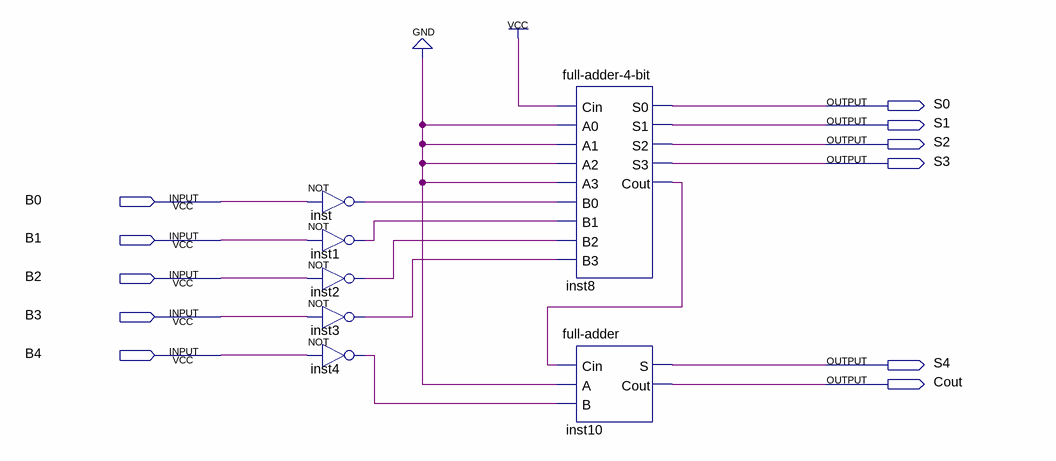
[diagram p0: schematic sheet]
// Quartus schematic bloco_Complemento2.bdf as structural Verilog: 7 symbols, 11 pins
module bloco_Complemento2 (
  input  B0,
  input  B1,
  input  B2,
  input  B3,
  input  B4,
  output S0,
  output S1,
  output S2,
  output S3,
  output S4,
  output Cout
);

  wire inst1_out, inst2_out, inst3_out, inst4_out, inst8_cout, inst_out;

  not inst (inst_out, B0);
  not inst1 (inst1_out, B1);
  not inst2 (inst2_out, B2);
  not inst3 (inst3_out, B3);
  not inst4 (inst4_out, B4);
  \full-adder-4-bit  inst8 (
    .Cin(1'b1), .A0(1'b0), .A1(1'b0), .A2(1'b0), .A3(1'b0), .B0(inst_out), .B1(inst1_out), .B2(inst2_out),
    .B3(inst3_out), .S0(S0), .S1(S1), .S2(S2), .S3(S3), .Cout(inst8_cout));
  \full-adder  inst10 (.Cin(inst8_cout), .A(1'b0), .B(inst4_out), .S(S4), .Cout(Cout));
endmodule
